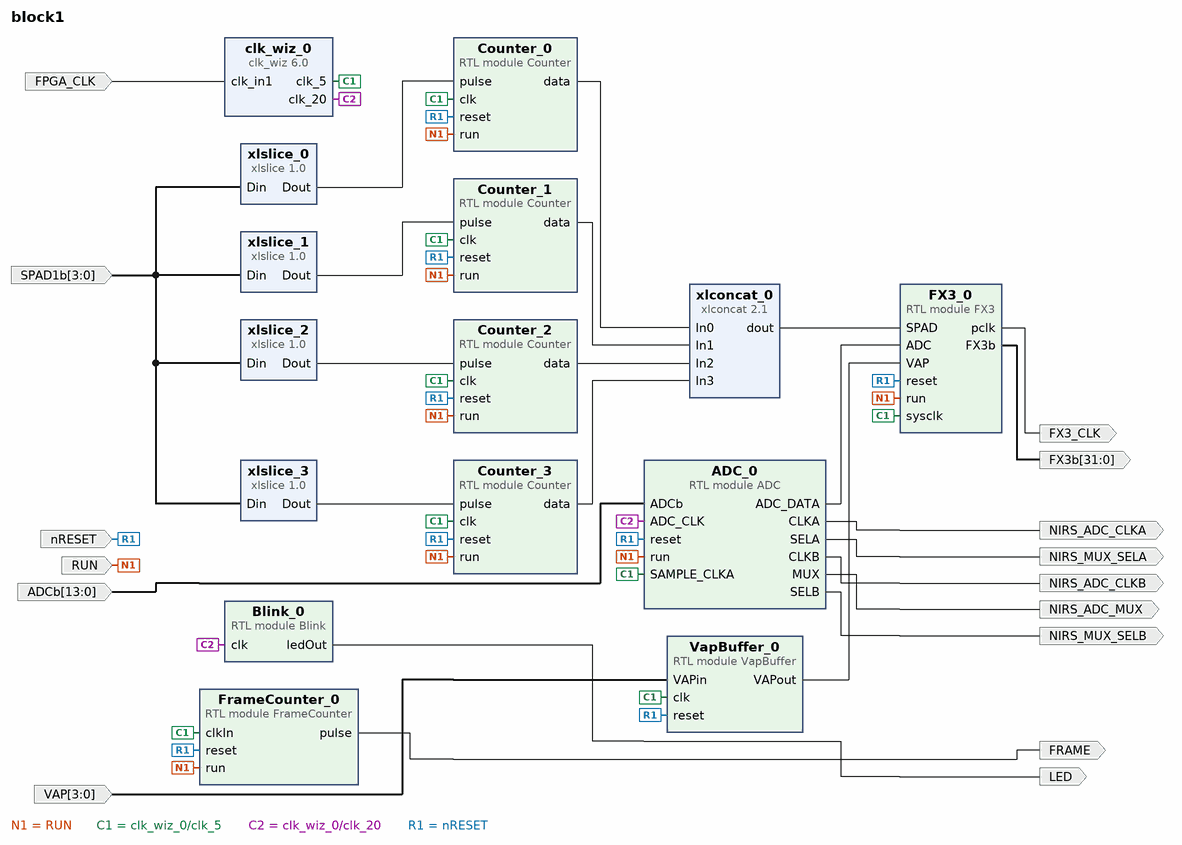
[diagram p0: block diagram of the top level]
# Vivado block design block1, xc7a100tcsg324-2, Vivado 2018.3
create_bd_design block1

create_bd_port -dir I -type clk FPGA_CLK
set_property -dict {CONFIG.FREQ_HZ 20000000} [get_bd_ports FPGA_CLK]
create_bd_port -dir I -from 13 -to 0 ADCb
create_bd_port -dir I -from 3 -to 0 VAP
create_bd_port -dir I RUN
create_bd_port -dir I -from 3 -to 0 SPAD1b
create_bd_port -dir O -from 31 -to 0 FX3b
create_bd_port -dir O FX3_CLK
create_bd_port -dir O FRAME
create_bd_port -dir O LED
create_bd_port -dir O NIRS_MUX_SELA
create_bd_port -dir O NIRS_MUX_SELB
create_bd_port -dir O NIRS_ADC_MUX
create_bd_port -dir I -type rst nRESET
set_property -dict {CONFIG.POLARITY ACTIVE_LOW} [get_bd_ports nRESET]
create_bd_port -dir O NIRS_ADC_CLKB
create_bd_port -dir O NIRS_ADC_CLKA

create_bd_cell -type module -reference ADC ADC_0
create_bd_cell -type module -reference Blink Blink_0
create_bd_cell -type module -reference FrameCounter FrameCounter_0
create_bd_cell -type module -reference VapBuffer VapBuffer_0
create_bd_cell -type module -reference Counter Counter_0
create_bd_cell -type module -reference Counter Counter_1
create_bd_cell -type module -reference Counter Counter_2
create_bd_cell -type module -reference Counter Counter_3
create_bd_cell -type module -reference FX3 FX3_0
create_bd_cell -type ip -vlnv xilinx.com:ip:clk_wiz:6.0 clk_wiz_0
set_property -dict [list \
  CONFIG.CLKIN1_JITTER_PS 500.0 \
  CONFIG.CLKOUT1_DRIVES BUFGCE \
  CONFIG.CLKOUT1_JITTER 621.795 \
  CONFIG.CLKOUT1_PHASE_ERROR 346.848 \
  CONFIG.CLKOUT1_REQUESTED_OUT_FREQ 20.000 \
  CONFIG.CLKOUT2_DRIVES BUFGCE \
  CONFIG.CLKOUT2_JITTER 820.791 \
  CONFIG.CLKOUT2_PHASE_ERROR 346.848 \
  CONFIG.CLKOUT2_REQUESTED_OUT_FREQ 5.000 \
  CONFIG.CLKOUT2_USED true \
  CONFIG.CLKOUT3_DRIVES BUFGCE \
  CONFIG.CLKOUT3_JITTER 820.791 \
  CONFIG.CLKOUT3_PHASE_ERROR 346.848 \
  CONFIG.CLKOUT3_REQUESTED_OUT_FREQ 5.000 \
  CONFIG.CLKOUT3_REQUESTED_PHASE 90 \
  CONFIG.CLKOUT3_USED false \
  CONFIG.CLKOUT4_DRIVES BUFGCE \
  CONFIG.CLKOUT5_DRIVES BUFGCE \
  CONFIG.CLKOUT6_DRIVES BUFGCE \
  CONFIG.CLKOUT7_DRIVES BUFGCE \
  CONFIG.CLK_OUT1_PORT clk_20 \
  CONFIG.CLK_OUT2_PORT clk_5 \
  CONFIG.CLK_OUT3_PORT clk_5N \
  CONFIG.FEEDBACK_SOURCE FDBK_AUTO \
  CONFIG.MMCM_CLKFBOUT_MULT_F 32.000 \
  CONFIG.MMCM_CLKIN1_PERIOD 50.000 \
  CONFIG.MMCM_CLKIN2_PERIOD 10.0 \
  CONFIG.MMCM_CLKOUT0_DIVIDE_F 32.000 \
  CONFIG.MMCM_CLKOUT1_DIVIDE 128 \
  CONFIG.MMCM_CLKOUT2_DIVIDE 1 \
  CONFIG.MMCM_CLKOUT2_PHASE 90.000 \
  CONFIG.MMCM_COMPENSATION ZHOLD \
  CONFIG.MMCM_DIVCLK_DIVIDE 1 \
  CONFIG.NUM_OUT_CLKS 2 \
  CONFIG.PRIMITIVE MMCM \
  CONFIG.PRIM_IN_FREQ 20.000 \
  CONFIG.USE_LOCKED false \
  CONFIG.USE_RESET false \
  CONFIG.USE_SAFE_CLOCK_STARTUP true \
] [get_bd_cells clk_wiz_0]
create_bd_cell -type ip -vlnv xilinx.com:ip:xlconcat:2.1 xlconcat_0
set_property -dict [list \
  CONFIG.IN0_WIDTH 3 \
  CONFIG.IN1_WIDTH 3 \
  CONFIG.IN2_WIDTH 3 \
  CONFIG.IN3_WIDTH 3 \
  CONFIG.NUM_PORTS 4 \
  CONFIG.dout_width 12 \
] [get_bd_cells xlconcat_0]
create_bd_cell -type ip -vlnv xilinx.com:ip:xlslice:1.0 xlslice_0
set_property -dict {CONFIG.DIN_FROM 0 CONFIG.DIN_TO 0 CONFIG.DIN_WIDTH 4} [get_bd_cells xlslice_0]
create_bd_cell -type ip -vlnv xilinx.com:ip:xlslice:1.0 xlslice_1
set_property -dict {CONFIG.DIN_FROM 1 CONFIG.DIN_TO 1 CONFIG.DIN_WIDTH 4 CONFIG.DOUT_WIDTH 1} [get_bd_cells xlslice_1]
create_bd_cell -type ip -vlnv xilinx.com:ip:xlslice:1.0 xlslice_2
set_property -dict {CONFIG.DIN_FROM 2 CONFIG.DIN_TO 2 CONFIG.DIN_WIDTH 4 CONFIG.DOUT_WIDTH 1} [get_bd_cells xlslice_2]
create_bd_cell -type ip -vlnv xilinx.com:ip:xlslice:1.0 xlslice_3
set_property -dict {CONFIG.DIN_FROM 3 CONFIG.DIN_TO 3 CONFIG.DIN_WIDTH 4 CONFIG.DOUT_WIDTH 1} [get_bd_cells xlslice_3]

# ---- connections ----

connect_bd_net [get_bd_ports FPGA_CLK] [get_bd_pins clk_wiz_0/clk_in1]
connect_bd_net [get_bd_ports ADCb] [get_bd_pins ADC_0/ADCb]
connect_bd_net [get_bd_ports VAP] [get_bd_pins VapBuffer_0/VAPin]
connect_bd_net [get_bd_ports RUN] \
  [get_bd_pins FrameCounter_0/run] [get_bd_pins Counter_3/run] [get_bd_pins Counter_2/run] [get_bd_pins Counter_1/run] \
  [get_bd_pins Counter_0/run] [get_bd_pins FX3_0/run] [get_bd_pins ADC_0/run]
connect_bd_net [get_bd_pins Counter_0/data] [get_bd_pins xlconcat_0/In0]
connect_bd_net [get_bd_pins Counter_1/data] [get_bd_pins xlconcat_0/In1]
connect_bd_net [get_bd_pins Counter_2/data] [get_bd_pins xlconcat_0/In2]
connect_bd_net [get_bd_pins Counter_3/data] [get_bd_pins xlconcat_0/In3]
connect_bd_net [get_bd_pins xlconcat_0/dout] [get_bd_pins FX3_0/SPAD]
connect_bd_net [get_bd_pins VapBuffer_0/VAPout] [get_bd_pins FX3_0/VAP]
connect_bd_net [get_bd_pins ADC_0/ADC_DATA] [get_bd_pins FX3_0/ADC]
connect_bd_net [get_bd_ports SPAD1b] [get_bd_pins xlslice_0/Din] [get_bd_pins xlslice_1/Din] [get_bd_pins xlslice_2/Din] [get_bd_pins xlslice_3/Din]
connect_bd_net [get_bd_pins xlslice_0/Dout] [get_bd_pins Counter_0/pulse]
connect_bd_net [get_bd_pins xlslice_1/Dout] [get_bd_pins Counter_1/pulse]
connect_bd_net [get_bd_pins xlslice_2/Dout] [get_bd_pins Counter_2/pulse]
connect_bd_net [get_bd_pins xlslice_3/Dout] [get_bd_pins Counter_3/pulse]
connect_bd_net [get_bd_pins FX3_0/FX3b] [get_bd_ports FX3b]
connect_bd_net [get_bd_pins FX3_0/pclk] [get_bd_ports FX3_CLK]
connect_bd_net [get_bd_pins FrameCounter_0/pulse] [get_bd_ports FRAME]
connect_bd_net [get_bd_pins Blink_0/ledOut] [get_bd_ports LED]
connect_bd_net [get_bd_pins ADC_0/SELA] [get_bd_ports NIRS_MUX_SELA]
connect_bd_net [get_bd_pins ADC_0/SELB] [get_bd_ports NIRS_MUX_SELB]
connect_bd_net [get_bd_pins ADC_0/MUX] [get_bd_ports NIRS_ADC_MUX]
connect_bd_net [get_bd_pins clk_wiz_0/clk_5] \
  [get_bd_pins ADC_0/SAMPLE_CLKA] [get_bd_pins FrameCounter_0/clkIn] [get_bd_pins Counter_3/clk] [get_bd_pins Counter_0/clk] \
  [get_bd_pins Counter_1/clk] [get_bd_pins Counter_2/clk] [get_bd_pins VapBuffer_0/clk] [get_bd_pins FX3_0/sysclk]
connect_bd_net [get_bd_pins clk_wiz_0/clk_20] [get_bd_pins ADC_0/ADC_CLK] [get_bd_pins Blink_0/clk]
connect_bd_net [get_bd_ports nRESET] \
  [get_bd_pins FrameCounter_0/reset] [get_bd_pins Counter_0/reset] [get_bd_pins Counter_3/reset] \
  [get_bd_pins Counter_2/reset] [get_bd_pins Counter_1/reset] [get_bd_pins VapBuffer_0/reset] [get_bd_pins ADC_0/reset] \
  [get_bd_pins FX3_0/reset]
connect_bd_net [get_bd_pins ADC_0/CLKB] [get_bd_ports NIRS_ADC_CLKB]
connect_bd_net [get_bd_pins ADC_0/CLKA] [get_bd_ports NIRS_ADC_CLKA]

validate_bd_design
save_bd_design
